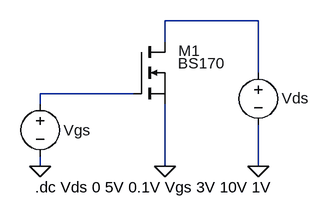
[diagram p0: schematic MOSFET_Out.asc]
MOSFET_Out.asc, the LTspice schematic file:
Version 4.1
SHEET 1 1292 680
WIRE -576 -96 -720 -96
WIRE -720 -64 -720 -96
WIRE -576 -16 -576 -96
WIRE -768 16 -912 16
WIRE -912 32 -912 16
WIRE -912 128 -912 112
WIRE -720 128 -720 32
WIRE -576 128 -576 64
FLAG -576 128 0
FLAG -912 128 0
FLAG -720 128 0
SYMBOL voltage -576 -32 R0
WINDOW 123 0 0 Left 2
WINDOW 39 37 60 Left 2
WINDOW 0 36 55 Left 2
WINDOW 3 37 60 Left 2
SYMATTR InstName Vds
SYMATTR Value ""
SYMBOL voltage -912 16 R0
WINDOW 123 0 0 Left 2
WINDOW 39 40 53 Left 2
WINDOW 3 40 69 Left 2
WINDOW 0 36 56 Left 2
SYMATTR Value ""
SYMATTR InstName Vgs
SYMBOL nmos -768 -64 R0
WINDOW 0 69 14 Left 2
WINDOW 3 68 33 Left 2
SYMATTR InstName M1
SYMATTR Value BS170
TEXT -920 160 Left 2 !.dc Vds 0 5V 0.1V Vgs 3V 10V 1V

The netlist it stands for:
* MOSFET_Out.asc
Vds N001 0
Vgs N002 0
M1 N001 N002 0 0 BS170
.model NMOS NMOS
.model PMOS PMOS
.lib standard.mos
.dc Vds 0 5V 0.1V Vgs 3V 10V 1V
.backanno
.end